# EasyEDA Pro project ProPrj_BrainStimulator-4Channels-Prototype_2025-12-16.epro, board PCB2
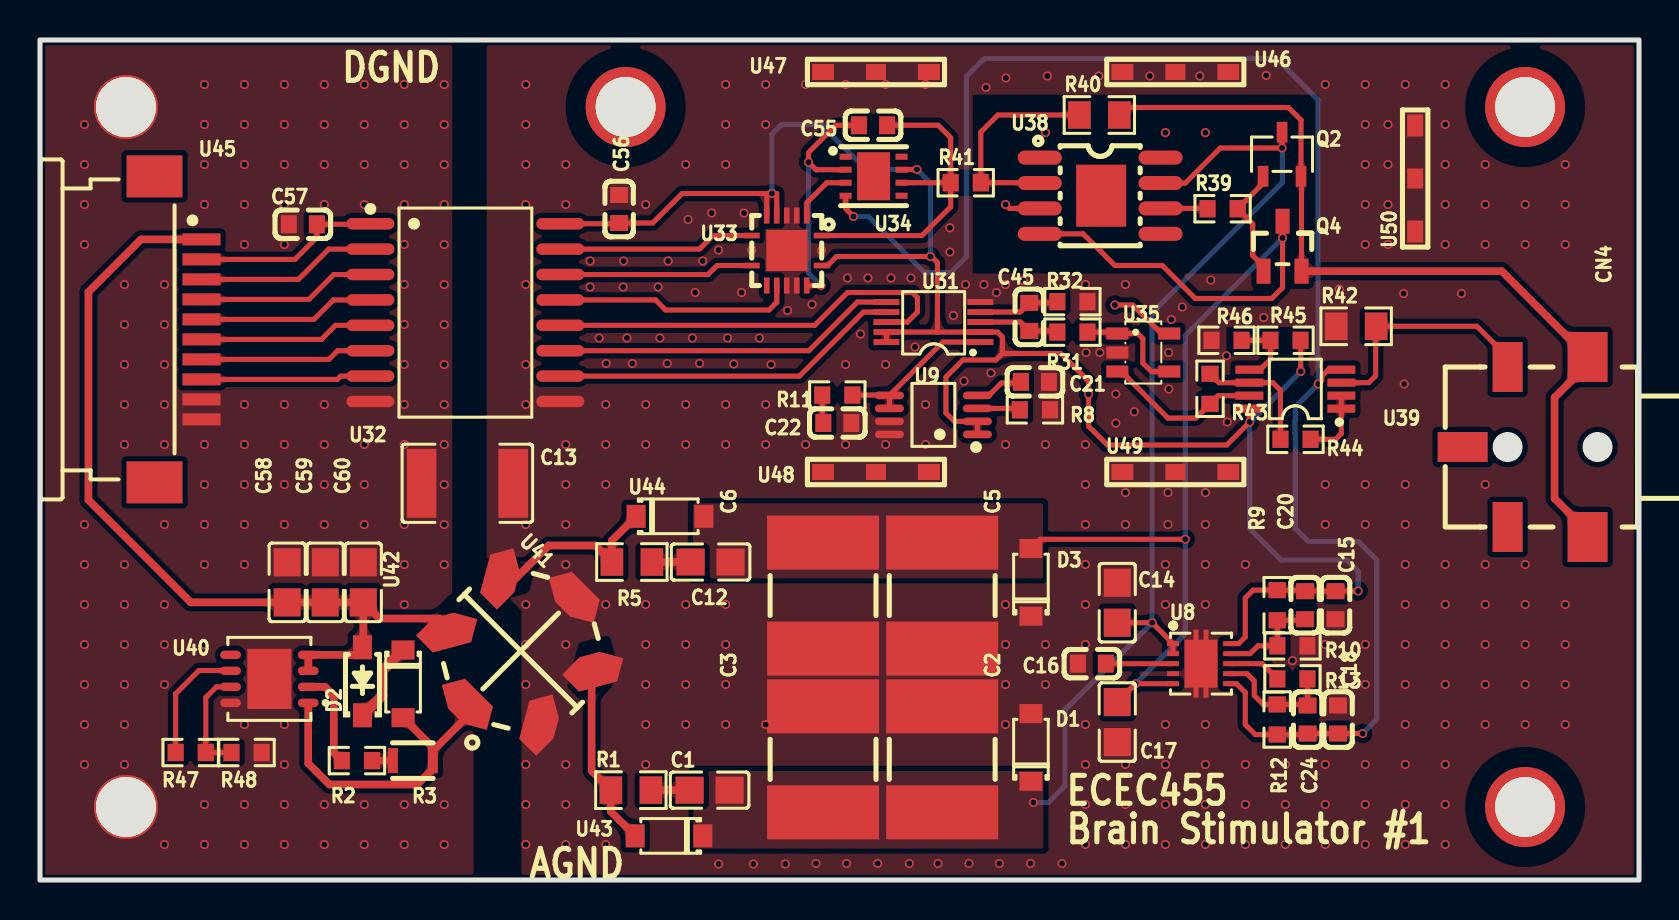
[diagram p9: board, top side]
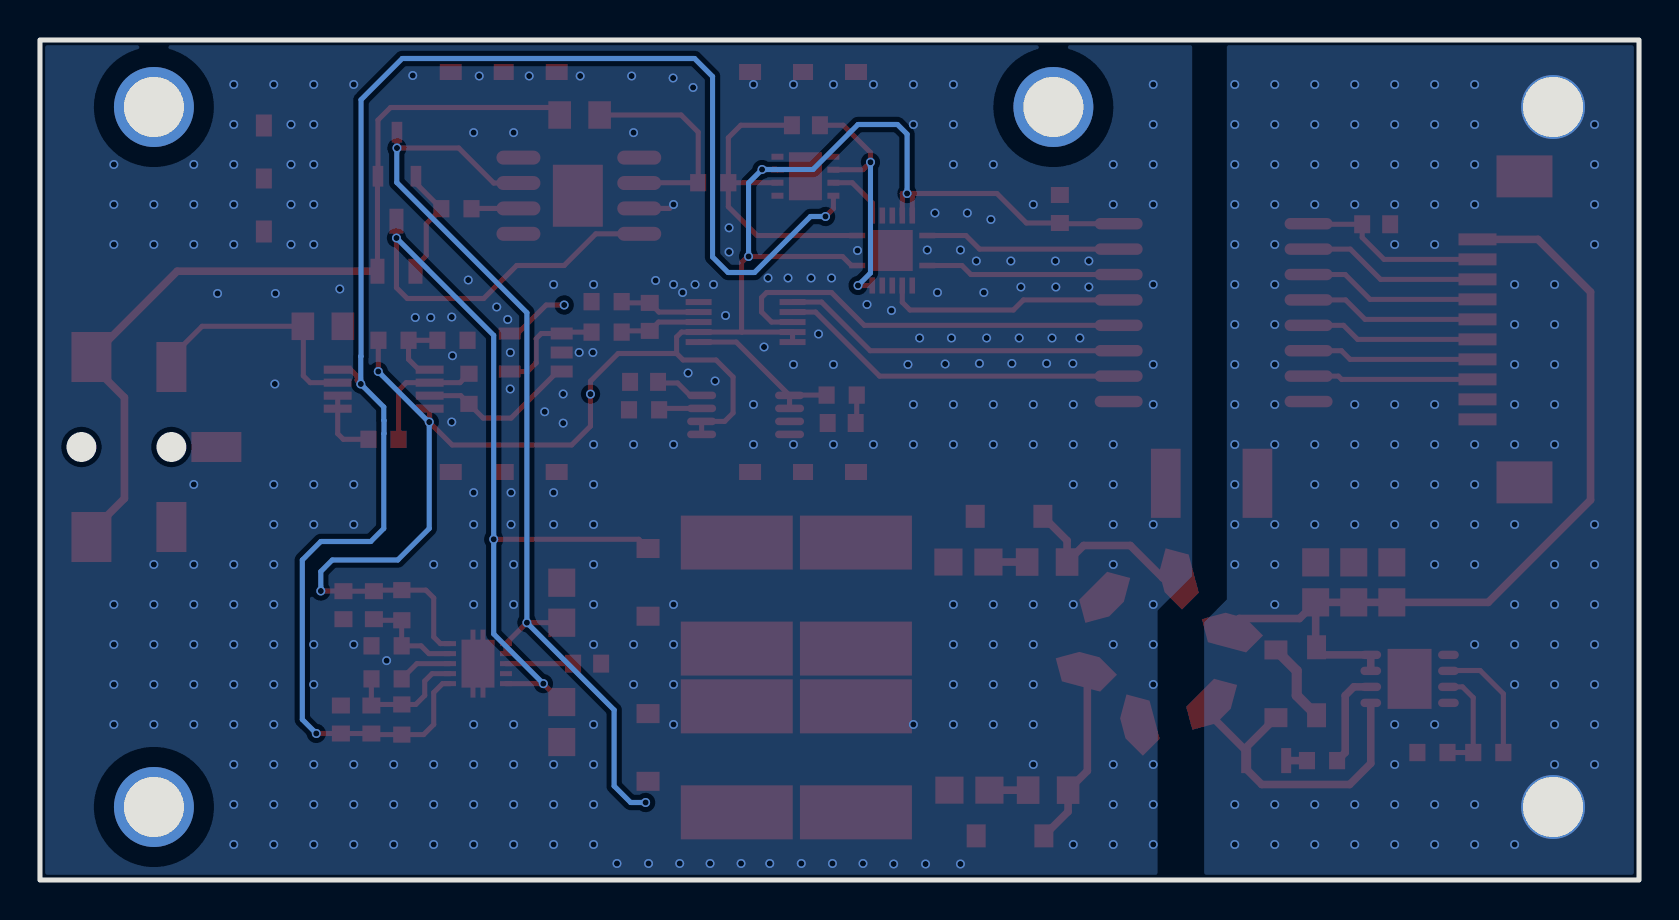
[diagram p10: board, bottom side, seen from below]

Outline 80 x 42 mm; copper layers: Top Layer, Inner1, Inner2, Bottom Layer. Coordinates in mm from the lower left corner of the outline.
Outline path: rectangle 0,42 80,0
Stack: Top Layer 0.035mm Outer layer thickness 1oz / Dielectric1 0.2104mm 7628 RC49% 8.6mil / Inner1 0.0152mm Inner layer thickness / Dielectric2 1.065mm 1.1mm H/HOZ Copper / Inner2 0.0152mm Inner layer thickness / Dielectric3 0.2104mm 7628 RC49% 8.6mil / Bottom Layer 0.035mm Outer layer thickness 1oz

## Design rules (mm)
spacing copperThickness1oz (default): track to track 0.102, other pairs 0.152 to 0.3
spacing copperThickness2oz: track to track 0.203, other pairs 0.152 to 0.3
spacing safeClearance_30V: track to track 0.254, other pairs 0.152 to 0.3
track width copperThickness1oz (default): min 0.127, default 0.254, max 2.54
track width copperThickness2oz: min 0.203, default 0.254, max 2.54
differential pair differentialPair (default): width min 0.127, default 0.254, max 2.54; gap min 0.152, default 0.152
pour e370 uses copperRegion_30V, safeClearance_30V
net AGND uses copperRegion_30V
net GND uses copperRegion_30V
net CH0_+5V uses copperRegion
pour e372 uses copperRegion_30V, safeClearance_30V
pour e548 uses copperRegion_30V, default
['net', 'agnd'] ['NET', '$1N3'] uses default

## Placement (name value [footprint] x y rotation side)
C1  22pF  [C0805]  33.5 4.49 0 top
C2  47uF  [CAP-SMD_L6.1-W5.3-L]  45.14 6.03 270 top
C3  47uF  [CAP-SMD_L6.1-W5.3-L]  39.18 6.03 270 top
C5  47uF  [CAP-SMD_L6.1-W5.3-L]  45.14 14.22 270 top
C6  47uF  [CAP-SMD_L6.1-W5.3-L]  39.18 14.22 270 top
C12  22pF  [C0805]  33.55 15.9 0 top
C13  1nF  [C1812]  21.38 19.84 0 top
C14  10uF  [C0805]  53.9 13.87 90 top
C15  10uF  [C0603]  64.82 13.74 270 top
C16  10nF  [C0603]  52.63 10.82 0 top
C17  10uF  [C0805]  53.9 7.9 90 top
C18  10uF  [C0603]  64.95 8.02 270 top
C20  10nF  [C0603]  63.29 13.74 270 top
C21  1uF  [C0603]  49.78 24.91 180 top
C22  22uF  [C0603]  39.89 22.85 0 top
C24  10nF  [C0603]  63.42 8.02 90 top
C45  1nF  [C0603]  49.49 28.16 270 top
C55  100nF  [C0603]  41.68 37.74 0 top
C56  100nF  [C0603]  28.98 33.55 90 top
C57  100nF  [C0603]  13.15 32.79 180 top
C58  10uF  [C0805]  12.37 14.88 270 top
C59  10uF  [C0805]  14.27 14.88 270 top
C60  100nF  [C0805]  16.18 14.88 270 top
CN4  SJ1-42534-SMT-TR  [AUDIO-SMD_SJ1-42534-SMT-TR]  74.3 21.65 270 top
D1  BZT52C30  [SOD-123_L2.8-W1.8-LS3.7-RD]  49.58 6.63 90 top
D2  BZT52C39  [SOD-123_L2.7-W1.6-LS3.7-RD-1]  16.13 9.94 90 top
D3  BZT52C30  [SOD-123_L2.8-W1.8-LS3.7-RD]  49.58 14.88 90 top
NOREF  -  [Pad_e987]  29.3 38.65 0 top
NOREF#2  -  [Pad_e985]  74.3 38.65 0 top
NOREF#3  -  [Pad_e983]  4.3 3.65 0 top
NOREF#4  -  [Pad_e986]  74.3 3.65 0 top
NOREF#5  -  [Pad_e984]  4.3 38.65 0 top
Q2  2N3904S-HXY  [SOT-23-3_L3.0-W1.7-P0.95-LS2.9-BR]  62.14 36.29 270 top
Q4  2N3906S-RTK/PS  [SOT-23-3_L2.9-W1.3-P1.90-LS2.4-TR]  62.17 31.69 270 top
R1  100Ω  [R0805]  29.56 4.49 0 top
R2  2.2kΩ  [R0603]  15.86 5.97 0 top
R3  301kΩ  [RES-SMD_L2.0-W1.3]  18.65 5.97 0 top
R5  100Ω  [R0805]  29.61 15.9 0 top
R8  120kΩ  [R0603]  49.78 23.51 180 top
R9  32.4kΩ  [R0603]  61.9 13.74 270 top
R10  10kΩ  [R0603]  62.66 11.71 0 top
R11  220mΩ  [R0603]  39.89 24.25 180 top
R12  42.2kΩ  [R0603]  61.9 8.02 90 top
R13  10kΩ  [R0603]  62.66 10.06 180 top
R31  15Ω  [R0603]  51.65 27.39 0 top
R32  15Ω  [R0603]  51.65 28.92 0 top
R39  20Ω  [R0603]  59.17 33.56 0 top
R40  5.1kΩ  [R0805]  53 38.25 0 top
R41  1kΩ  [R0603]  46.32 34.86 0 top
R42  30Ω  [R0805]  65.85 27.69 0 top
R43  50kΩ  [R0603]  58.54 24.56 270 top
R44  10kΩ  [R0603]  62.81 22.04 180 top
R45  15kΩ  [R0603]  62.31 26.98 180 top
R46  1kΩ  [R0603]  59.36 26.98 180 top
R47  604kΩ  [R0603]  7.54 6.37 0 top
R48  12.1kΩ  [R0603]  10.33 6.37 0 top
U8  TPS7A3901DSCR  [WSON-10_L3.0-W3.0-P0.50-BL-EP]  58.09 10.82 270 top
U9  REF6050IDGKR  [VSSOP-8_L3.0-W3.0-P0.65-LS4.9-BL]  44.7 23.26 90 top
U31  ADS8860IDGSR  [VSSOP-10_L3.0-W3.0-P0.50-LS4.9-BL]  44.7 27.9 90 top
U32  ISO7761DWR  [SOIC-16_L10.3-W7.5-P1.27-LS10.3-BL]  21.28 28.37 270 top
U33  DAC8831ICRGYT  [VQFN-14_L3.5-W3.5-P0.50-BL-EP]  37.36 31.47 180 top
U34  OPA727AIDRBT  [SON-8_L3.0-W3.0-P0.65-TL-EP]  41.7 35.19 0 top
U35  OPA320AIDBVR  [SOT-23-5_L3.0-W1.7-P0.95-LS2.8-BR]  55.2 26.37 180 top
U38  ADA4700-1ARDZ-R7  [SOIC-8_L4.9-W3.9-P1.27-LS6.0-BL-EP3.1]  53.04 34.21 270 top
U39  ADA4841-2YRMZ-R7  [MSOP-8_L3.0-W3.0-P0.65-LS4.9-BL]  62.81 24.54 90 top
U40  LM25184NGUR  [WSON-8_L4.0-W4.0-P0.80-BL-EP]  11.48 10.06 90 top
U41  -  [LPH8045]  24.05 11.45 135 top
U42  SS16FP  [SOD-123_L2.8-W1.8-LS3.7-RD]  18.17 9.81 270 top
U43  SS16FP  [SOD-123_L2.8-W1.8-LS3.7-RD]  31.47 2.21 180 top
U44  SS16FP  [SOD-123_L2.8-W1.8-LS3.7-RD]  31.52 18.18 0 top
U45  522711069  [FPC-SMD_10P-P1.00_522711069]  6.91 27.53 270 top
U46  ICSRC6508-025SFR  [SMD-3P_L6.5-W0.8_ICSRC6508-030SFR]  56.8 40.4 0 top
U47  ICSRC6508-025SFR  [SMD-3P_L6.5-W0.8_ICSRC6508-030SFR]  41.83 40.4 0 top
U48  ICSRC6508-025SFR  [SMD-3P_L6.5-W0.8_ICSRC6508-030SFR]  41.83 20.4 0 top
U49  ICSRC6508-025SFR  [SMD-3P_L6.5-W0.8_ICSRC6508-030SFR]  56.8 20.4 0 top
U50  ICSRC6508-025SFR  [SMD-3P_L6.5-W0.8_ICSRC6508-030SFR]  68.8 35.08 90 top

## Footprints (pads in the part's own frame, mm; a bottom-side part is the same pattern mirrored in y, then rotated)
AUDIO-SMD_SJ1-42534-SMT-TR
  rect 1.5x2.5 smd: 1(0,-3.125)
  rect 2.5x1.5 smd: 2(-4,-0.875) 3(4,-0.875)
  rect 2.5x2 smd: 4(-4.5,3.125) 4(4.5,3.125)
C0603
  rect 0.8x0.9 smd: 1(-0.7,0) 2(0.7,0)
C0805
  rect 1.41x1.35 smd: 1(-1,0) 2(1,0)
C1812
  rect 1.485x3.456 smd: 1(-2.292,0) 2(2.292,0)
CAP-SMD_L6.1-W5.3-L
  rect 2.7x5.6 smd: 1(-2.65,0) 2(2.65,0)
FPC-SMD_10P-P1.00_522711069
  rect 0.6x1.9 smd: 1(-4.5,1.175) 2(-3.5,1.175) 3(-2.5,1.175) 4(-1.5,1.175) 5(-0.5,1.175) 6(0.5,1.175) 7(1.5,1.175) 8(2.5,1.175) 9(3.5,1.175) 10(4.5,1.175)
  rect 2.1x2.8 smd: MP1(-7.65,-1.175) MP2(7.65,-1.175)
LPH8045
  custom 3.174x1.651 smd: 1(0,3.782) 4(0,-3.782)
  custom 2.184x2.748 smd rot 60: 2(-3.276,1.891) 5(3.276,-1.891)
  custom 2.184x2.748 smd rot 120: 3(-3.276,-1.891) 6(3.276,1.891)
MSOP-8_L3.0-W3.0-P0.65-LS4.9-BL
  rect 0.406x1.397 smd: 1(-0.975,-2.3) 2(-0.325,-2.3) 3(0.325,-2.3) 4(0.975,-2.3) 5(0.975,2.3) 6(0.325,2.3) 7(-0.325,2.3) 8(-0.975,2.3)
Pad_e983
  round 3.2 hole 3: 1(0,0)
Pad_e984
  round 3.2 hole 3: 1(0,0)
Pad_e985
  round 4 hole 3: 1(0,0)
Pad_e986
  round 4 hole 3: 1(0,0)
Pad_e987
  round 4 hole 3: 1(0,0)
R0603
  rect 0.806x0.864 smd: 1(-0.753,0) 2(0.753,0)
R0805
  rect 1.133x1.377 smd: 1(-1,0) 2(1,0)
RES-SMD_L2.0-W1.3
  rect 0.5x1.25 smd: 1(-1,0) 2(1,0)
SMD-3P_L6.5-W0.8_ICSRC6508-030SFR
  rect 1.1x0.8 smd: 1(-2.65,0) 3(2.65,0)
  rect 1x0.8 smd: 2(0,0)
SOD-123_L2.7-W1.6-LS3.7-RD-1
  rect 1.2x0.95 smd: 1(-1.7,0) 2(1.7,0)
SOD-123_L2.8-W1.8-LS3.7-RD
  rect 0.95x1.15 smd: 1(-1.692,0) 2(1.692,0)
SOIC-8_L4.9-W3.9-P1.27-LS6.0-BL-EP3.1
  oval 0.7x2.2 smd: 1(-1.905,-3.022) 2(-0.635,-3.022) 3(0.635,-3.022) 4(1.905,-3.022) 5(1.905,3.022) 6(0.635,3.022) 7(-0.635,3.022) 8(-1.905,3.022)
  rect 3.1x2.5 smd: 9(0,0.051)
SOIC-16_L10.3-W7.5-P1.27-LS10.3-BL
  oval 0.574x2.401 smd: 1(-4.445,-4.75) 2(-3.175,-4.75) 3(-1.905,-4.75) 4(-0.635,-4.75) 5(0.635,-4.75) 6(1.905,-4.75) 7(3.175,-4.75) 8(4.445,-4.75) 9(4.445,4.75) 10(3.175,4.75) 11(1.905,4.75) 12(0.635,4.75) 13(-0.635,4.75) 14(-1.905,4.75) 15(-3.175,4.75) 16(-4.445,4.75)
SON-8_L3.0-W3.0-P0.65-TL-EP
  rect 0.6x0.3 smd: 1(-1.4,0.976) 2(-1.4,0.325) 3(-1.4,-0.325) 4(-1.4,-0.976) 5(1.4,-0.976) 6(1.4,-0.325) 7(1.4,0.325) 8(1.4,0.976)
  rect 1.65x2.4 smd: 9(0,0)
SOT-23-3_L2.9-W1.3-P1.90-LS2.4-TR
  rect 1.25x0.7 smd: 1(1.25,0.95) 2(1.25,-0.95) 3(-1.25,0)
SOT-23-3_L3.0-W1.7-P0.95-LS2.9-BR
  rect 1.038x0.532 smd: 1(1.101,-0.95) 2(1.101,0.95) 3(-1.101,0)
SOT-23-5_L3.0-W1.7-P0.95-LS2.8-BR
  rect 1.1x0.6 smd: 1(1.3,-0.95) 2(1.3,0) 3(1.3,0.95) 4(-1.3,0.95) 5(-1.3,-0.95)
VQFN-14_L3.5-W3.5-P0.50-BL-EP
  rect 0.8x0.28 smd: 1(-1.75,-0.75) 7(1.75,-0.75) 8(1.75,0.75) 14(-1.75,0.75)
  rect 0.28x0.8 smd: 2(-0.999,-1.75) 3(-0.498,-1.75) 4(0.002,-1.75) 5(0.501,-1.75) 6(1.002,-1.75) 9(1,1.75) 10(0.5,1.75) 11(0,1.75) 12(-0.5,1.75) 13(-1,1.75)
  rect 2.05x2.05 smd: 15(0,0)
VSSOP-8_L3.0-W3.0-P0.65-LS4.9-BL
  oval 0.38x1.45 smd: 1(-0.975,-2.2) 2(-0.325,-2.2) 3(0.325,-2.2) 4(0.975,-2.2) 5(0.975,2.2) 6(0.325,2.2) 7(-0.325,2.2) 8(-0.975,2.2)
VSSOP-10_L3.0-W3.0-P0.50-LS4.9-BL
  rect 0.3x1.3 smd: 1(-1,-2.35) 2(-0.5,-2.35) 3(0,-2.35) 4(0.5,-2.35) 5(1,-2.35) 6(1,2.35) 7(0.5,2.35) 8(0,2.35) 9(-0.5,2.35) 10(-1,2.35)
WSON-8_L4.0-W4.0-P0.80-BL-EP
  oval 0.42x1.035 smd: 1(-1.2,-1.942) 2(-0.4,-1.942) 3(0.4,-1.942) 4(1.2,-1.942) 5(1.2,1.942) 6(0.4,1.942) 7(-0.4,1.942) 8(-1.2,1.942)
  rect 3x2.2 smd: 9(0,0)
WSON-10_L3.0-W3.0-P0.50-BL-EP
  rect 0.25x0.6 smd: 1(-1.001,-1.4) 2(-0.5,-1.4) 3(0,-1.4) 4(0.5,-1.4) 5(1.001,-1.4) 6(1.001,1.4) 7(0.5,1.4) 8(0,1.4) 9(-0.5,1.4) 10(-1.001,1.4)
  custom 3.4x1.65 smd: 11(0,0)

## Nets
As in the schematic, except:
GND: C13.1 C57.2 C58.1 C59.1 C60.1 NOREF#3.1 NOREF#5.1 R48.2 U32.8 U40.8 U40.9 U45.9 U45.10

Pads without a net: CN4 1 3; NOREF 1; NOREF#2 1; NOREF#4 1; U33 9; U34 1 5 8 9; U38 1 5 8 9; U40 5; U45 MP1 MP2

## Via types
v1: diameter 0.45, hole 0.305, Top Layer to Bottom Layer, 412 vias

## Routing (per net, layer and track width the routed paths; a pad name or vN(x,y) marks a point on that pad's centre or on a via; arc(x,y) is an arc through that point)
3V3: length 9.6
  Top Layer w0.254: U32.1 16.5,32.79 C57.1 13.85,32.13 12.76,31.03 U45.2
AGND: length 1.8
  Top Layer w0.254: v1(48.3,33.78) 48.5,33.58 U38.3
  vias: v1(24.3,39.78) v1(24.3,37.78) v1(24.3,35.78) v1(24.3,33.78) v1(24.3,29.78) v1(24.3,25.78) v1(24.3,23.78) v1(24.3,17.78) v1(24.3,13.78) v1(24.3,11.78) v1(24.3,9.78) v1(24.3,5.78) v1(24.3,3.78) v1(24.3,1.78) v1(26.3,35.78) v1(26.3,33.78) v1(26.3,21.78) v1(26.3,19.78) v1(26.3,17.78) v1(26.3,15.78) v1(26.3,11.78) v1(26.3,5.78) v1(26.3,3.78) v1(26.3,1.78) v1(27.52,30.95) v1(27.52,29.65) v1(27.98,27.1) v1(28.33,25.83) v1(28.3,23.78) v1(28.3,21.78) v1(28.3,19.78) v1(28.3,13.78) v1(28.3,1.78) v1(29.2,30.95) v1(29.18,29.65) v1(29.37,27.1) v1(29.64,25.83) v1(30.3,33.78) v1(30.3,23.78) v1(30.3,21.78) v1(30.3,13.78) v1(30.3,11.78) v1(30.3,9.78) v1(30.3,7.78) v1(30.3,5.78) v1(30.92,29.65) v1(31.01,27.1) v1(31.43,30.95) v1(31.38,25.83) v1(32.3,35.78) v1(32.3,23.78) v1(32.3,21.78) v1(32.3,13.78) v1(32.3,11.78) v1(32.3,9.78) v1(32.3,7.78) v1(32.42,33.03) v1(32.64,27.1) v1(32.78,29.38) v1(33,25.83) v1(33.16,30.95) v1(33.61,33.35) v1(33.95,31.5) v1(33.95,0.8) v1(34.3,39.78) v1(34.3,37.78) v1(34.3,35.78) v1(34.3,23.78) v1(34.3,21.78) v1(34.3,13.78) v1(34.3,11.78) v1(34.3,9.78) v1(34.3,7.78) v1(34.4,27.1) v1(34.71,25.8) v1(35.1,29.38) v1(35.23,33.35) v1(35.61,31.5) v1(35.69,0.8) v1(35.99,27.1) v1(36.3,39.78) v1(36.3,37.78) v1(36.3,23.78) v1(36.3,21.78) v1(36.3,7.78) v1(36.58,25.78) v1(37.29,0.8) v1(37.4,28.48) v1(38.3,39.78) v1(38.3,21.78) v1(38.62,28.78) v1(38.83,0.83) v1(39.1,31.48) v1(40.3,39.78) v1(40.3,25.78) v1(40.3,21.78) v1(40.4,30.1) v1(40.35,0.83) v1(41.05,27.3) v1(41.42,30.1) v1(41.91,0.83) v1(42.3,39.78) v1(42.3,25.78) v1(42.3,21.78) v1(42.58,30.1) v1(43.49,0.83) v1(43.58,30.1) v1(43.77,26.65) v1(44.3,39.78) v1(44.3,23.78) v1(44.3,21.78) v1(44.92,0.83) v1(45.52,32.61) v1(45.52,31.4) v1(45.7,28.23) v1(46.23,24.95) v1(46.3,29.78) v1(46.48,0.83) v1(47.23,29.78) v1(47.33,39.62) v1(47.58,25.35) v1(47.85,29.38) v1(48,0.83) v1(48.33,40.1) v1(48.3,29.78) v1(48.3,21.78) v1(48.3,13.78) v1(48.3,11.78) v1(48.3,9.78) v1(48.3,7.78) v1(49.2,29.98) v1(49.55,0.83) v1(50.3,37.37) v1(50.3,21.78) v1(50.3,11.78) v1(50.3,9.78) v1(50.4,40.2) v1(51.13,0.83) v1(52.3,29.78) v1(52.34,26.37) v1(52.3,21.78) v1(52.3,19.78) v1(52.3,17.78) v1(52.3,15.78) v1(52.3,13.78) v1(52.3,11.78) v1(52.3,7.78) v1(52.3,5.78) v1(52.3,3.78) v1(52.3,1.78) v1(52.98,40.2) v1(53.02,26.38) v1(53.83,24.3) v1(53.83,22.84) v1(54.3,29.78) v1(54.3,19.37) v1(54.3,17.78) v1(54.3,5.78) v1(54.3,3.78) v1(54.3,1.78) v1(54.75,23.41) v1(55.52,40.2) v1(56.3,37.37) v1(56.3,15.78) v1(56.3,13.78) v1(56.3,7.78) v1(56.3,5.78) v1(56.3,3.78) v1(56.3,1.78) v1(56.43,19.37) v1(56.43,17.78) v1(56.47,26.37) v1(56.48,24.55) v1(56.6,28.03) v1(57.15,28.65) v1(58.02,40.2) v1(58.3,37.37) v1(58.3,19.37) v1(58.3,17.78) v1(58.3,15.78) v1(58.3,13.78) v1(58.3,7.78) v1(58.3,5.78) v1(58.3,3.78) v1(58.3,1.78) v1(58.58,30) v1(59.4,28.15) v1(59.36,26.21) v1(59.4,22.9) v1(60.3,15.78) v1(60.3,5.78) v1(60.3,3.78) v1(60.3,1.78) v1(60.45,28.12) v1(61.23,28.12) v1(61.35,40.23) v1(62.3,5.78) v1(62.3,3.78) v1(62.3,1.78) v1(62.66,10.97) v1(64.3,39.78) v1(64.3,19.78) v1(64.3,17.78) v1(64.3,11.78) v1(64.3,5.78) v1(64.3,3.78) v1(64.3,1.78) v1(65,29.55) v1(66.3,39.78) v1(66.3,37.78) v1(66.3,35.78) v1(66.3,33.78) v1(66.3,31.78) v1(66.3,19.78) v1(66.3,17.78) v1(66.3,11.78) v1(66.3,9.78) v1(66.3,5.78) v1(66.3,3.78) v1(66.3,1.78) v1(67.44,37.78) v1(67.44,35.78) v1(67.44,33.78) v1(67.44,31.78) v1(68.23,29.33) v1(68.25,24.8) v1(68.3,39.78) v1(68.3,19.78) v1(68.3,17.78) v1(68.3,15.78) v1(68.3,13.78) v1(68.3,11.78) v1(68.3,9.78) v1(68.3,7.78) v1(68.3,5.78) v1(68.3,3.78) v1(68.3,1.78) v1(70.3,39.78) v1(70.3,37.78) v1(70.3,35.78) v1(70.3,33.78) v1(70.3,31.78) v1(70.3,15.78) v1(70.3,13.78) v1(70.3,11.78) v1(70.3,9.78) v1(70.3,7.78) v1(70.3,5.78) v1(70.3,3.78) v1(70.3,1.78) v1(71.12,29.33) v1(72.3,35.78) v1(72.3,33.78) v1(72.3,31.78) v1(72.3,19.78) v1(72.3,15.78) v1(72.3,13.78) v1(72.3,11.78) v1(72.3,9.78) v1(72.3,7.78) v1(74.3,33.78) v1(74.3,31.78) v1(74.3,15.78) v1(74.3,13.78) v1(74.3,11.78) v1(74.3,9.78) v1(74.3,7.78) v1(76.3,35.78) v1(76.3,33.78) v1(76.3,31.78) v1(76.3,13.78) v1(76.3,11.78) v1(76.3,9.78) v1(76.3,7.78)
GND:
  vias: v1(2.22,37.78) v1(2.22,35.78) v1(2.22,33.78) v1(2.22,31.78) v1(2.22,17.78) v1(2.22,15.78) v1(2.22,13.78) v1(2.22,11.78) v1(2.22,9.78) v1(2.22,7.78) v1(2.22,5.78) v1(4.22,29.78) v1(4.22,27.78) v1(4.22,25.78) v1(4.22,23.78) v1(4.22,21.78) v1(4.22,15.78) v1(4.22,13.78) v1(4.22,11.78) v1(4.22,9.78) v1(4.22,7.78) v1(4.22,5.78) v1(6.22,29.78) v1(6.22,27.78) v1(6.22,25.78) v1(6.22,23.78) v1(6.22,21.78) v1(6.22,17.78) v1(6.22,13.78) v1(6.22,11.78) v1(6.22,9.78) v1(6.22,1.78) v1(8.22,39.78) v1(8.22,37.78) v1(8.22,35.78) v1(8.22,33.78) v1(8.22,21.78) v1(8.22,19.78) v1(8.22,17.78) v1(8.22,15.78) v1(8.22,11.78) v1(8.22,3.78) v1(8.22,1.78) v1(10.22,39.78) v1(10.22,37.78) v1(10.22,35.78) v1(10.22,33.78) v1(10.22,31.78) v1(10.22,23.78) v1(10.22,21.78) v1(10.22,19.78) v1(10.22,17.78) v1(10.22,15.78) v1(10.22,7.78) v1(10.22,3.78) v1(10.22,1.78) v1(12.22,39.78) v1(12.22,37.78) v1(12.22,35.78) v1(12.22,33.78) v1(12.22,31.78) v1(12.22,23.78) v1(12.22,21.78) v1(12.22,19.78) v1(12.22,17.78) v1(12.22,7.78) v1(12.22,5.78) v1(12.22,3.78) v1(12.22,1.78) v1(14.22,39.78) v1(14.22,37.78) v1(14.22,35.78) v1(14.22,33.78) v1(14.22,23.78) v1(14.22,21.78) v1(14.22,19.78) v1(14.22,17.78) v1(14.22,3.78) v1(14.22,1.78) v1(16.22,39.78) v1(16.22,37.78) v1(16.22,35.78) v1(16.22,33.78) v1(16.22,21.78) v1(16.22,19.78) v1(16.22,17.78) v1(16.22,3.78) v1(16.22,1.78) v1(18.22,39.78) v1(18.22,37.78) v1(18.22,35.78) v1(18.22,33.78) v1(18.22,31.78) v1(18.22,29.78) v1(18.22,27.78) v1(18.22,25.78) v1(18.22,23.78) v1(18.22,21.78) v1(18.22,17.78) v1(18.22,15.78) v1(18.22,13.78) v1(18.22,3.78) v1(18.22,1.78) v1(20.22,39.78) v1(20.22,37.78) v1(20.22,35.78) v1(20.22,33.78) v1(20.22,31.78) v1(20.22,29.78) v1(20.22,27.78) v1(20.22,25.78) v1(20.22,23.78) v1(20.22,21.78) v1(20.22,19.78) v1(20.22,17.78) v1(20.22,15.78) v1(20.22,3.78) v1(20.22,1.78)
ADC_CS: length 8.6
  Top Layer w0.254: U45.7 14.46,26.03 14.89,26.46 U32.6
ADC_MISO: length 8.5
  Top Layer w0.254: U32.7 15.04,25.19 14.88,25.03 U45.8
ADC_SCLK: length 8.7
  Top Layer w0.254: U45.6 14.08,27.03 14.78,27.73 U32.5
CH0_5VN_BUF: length 2.7
  Top Layer w0.254: R13.2 61.14,10.82 U8.8
CH0_5VN_FB: length 6.4
  Top Layer w0.254: U8.7 60.38,10.32 60.75,9.95 60.75,9.23 61.2,8.78 R12.2 63.37,8.78 C24.2 63.42,10.05 R13.1
CH0_5VP_FB: length 5.3
  Top Layer w0.254: C20.2 63.24,12.99 R9.2 61.91,12.98 R10.1 60.93,11.71 60.54,11.32 U8.9
CH0_+5V: length 107.6
  Top Layer w0.254: R45.1 63.08,26.98 v1(63.08,25.43) ; 48.15,26.33 48.15,27.15 47.9,27.4 U31.2 44.88,27.4 ; 48.15,26.33 51.08,26.33 52.46,24.94 v1(52.46,24.29) 52.46,22.69 53.4,21.75 59.37,21.75 v1(60.52,22.9) 60.51,22.92 U39.8 ; 48.15,26.33 47.83,26 46.17,26 45.33,25.15 45.33,23.35 45.74,22.93 U9.2 U9.1 ; v1(53.77,28.75) 54.67,28.75 56.1,27.32 U35.5 ; U33.6 36.36,34.32 36.36,34.33 ; 36.36,34.33 32.12,34.33 30.65,32.85 C56.1 28.94,32.81 U32.16 ; 36.36,34.33 v1(36.62,34.33) 36.86,34.33 U33.5 ; v1(65.95,14.45) 64.83,14.45 C15.1 C20.1 63.24,14.49 R9.1 60.69,14.49 60.3,14.1 60.3,12.15 59.97,11.82 59.49,11.82 ; 44.88,27.4 U31.9 U31.10 ; 44.88,27.4 44.9,27.41 44.9,30.88 44.6,31.18 39.85,31.18 39.4,30.72 U33.14 ; U34.7 43.12,35.53 v1(43.87,35.53)
  Inner2 w0.254: v1(52.46,24.29) 51.65,25.1 51.65,27.62 52.77,28.75 v1(53.77,28.75)
  Bottom Layer w0.254: v1(44.55,31.18) 44.55,34.85 v1(43.87,35.53) 41.33,35.53 39.08,37.78 37.1,37.78 36.62,37.29 v1(36.62,34.33) ; v1(65.95,14.45) 65.95,15.43 65.37,16 62.1,16 60.52,17.58 v1(60.52,22.9) 60.55,22.9 v1(63.08,25.43)
CH0_+30V: length 49.6
  Top Layer w0.254: Q2.3 v1(62.14,36.6) 59.05,36.6 57.3,34.85 U38.7 ; C14.1 v1(55.64,12.87) 56.69,11.82 U8.2
  Bottom Layer w0.254: v1(62.14,36.6) 62.15,36.59 62.15,34.88 55.64,28.37 v1(55.64,12.87) 51.27,8.5 51.27,4.7 50.45,3.88 v1(49.7,3.88)
CH0_-5V: length 82.1
  Top Layer w0.254: U34.4 40.3,33.57 v1(40.7,33.18) ; v1(66.17,7.33) 64.95,7.33 ; 65.11,25.52 64.46,25.52 64.13,25.19 64.13,24.98 v1(63.95,24.8) ; U8.6 59.86,9.82 60.3,9.38 60.3,7.78 60.8,7.27 R12.1 63.37,7.27 C24.1 C18.2
  Bottom Layer w0.254: v1(40.7,33.18) 41.45,33.18 44.25,30.38 45.58,30.38 46.35,31.15 46.35,40.18 47.25,41.08 61.87,41.08 63.94,39.01 63.94,26.19 63.95,26.18 v1(63.95,24.8) 62.8,23.65 62.8,22.99 62.79,22.98 62.79,22.32 62.8,22.31 62.8,17.58 63.45,16.93 65.95,16.93 66.87,16 66.87,8.03 v1(66.17,7.33)
CH0_-30V: length 53.4
  Top Layer w0.254: C17.2 v1(54.82,9.82) U8.5 ; Q4.3 v1(62.17,32.1) 62.17,29.62 61.62,29.08 57.8,29.08 56.15,30.73 53.77,30.73 52.19,32.31 U38.4 ; v1(57.3,17.04) 50.04,17.04 D3.2
  Bottom Layer w0.254: v1(62.17,32.1) 57.3,27.23 v1(57.3,17.04) 57.3,12.3 v1(54.82,9.82)
CH0_ADC_IN_N: length 4.1
  Top Layer w0.254: U31.4 49.04,28.4 C45.1 50.84,28.86 R32.1
CH0_ADC_IN_P: length 4.1
  Top Layer w0.254: R31.1 50.84,27.46 C45.2 49.05,27.9 U31.3
CH0_ADC_VREF: length 8.2
  Top Layer w0.254: U31.1 45.17,26.9 U9.5 ; R11.1 42.48,24.25 U9.5 ; U9.5 U9.6
CH0_BRAIN_FB: length 12.1
  Top Layer w0.254: CN4.2 73.42,26.15 71.89,27.69 66.83,27.69 66.83,25.21 66.48,24.87 65.11,24.87
CH0_FLYBACK_FB: length 4.9
  Top Layer w0.381: R2.1 14.7,6.37 14.7,9.23 14.27,9.66 U40.2
CH0_FLYBACK_SW: length 15.8
  Top Layer w0.381: U41.1 21.38,8.18 19.65,6.45 19.65,6.63 U42.2 ; R3.2 19.65,5.55 18.88,4.78 14.47,4.78 13.42,5.83 U40.1
CH0_OPAMP_DAC: length 16.4
  Top Layer w0.254: U34.6 R41.1 ; R41.1 45.56,33.66 44.12,32.22 U33.1 ; R41.1 45.56,37.11 44.94,37.74 C55.2
CH0_OUT_BRAIN: length 43.5
  Top Layer w0.254: R40.2 54.37,38.62 62.46,38.62 63.09,38 63.09,35.19 63.12,35.16 Q4.1
  Top Layer w0.381: CN4.4 77.43,17.42 75.77,19.08 75.77,24.12 77.43,25.78 CN4.4 73.14,30.44 Q4.1
CH0_VSENSE_ADC: length 8
  Top Layer w0.254: U39.7 58.95,24.22 R43.2 57.83,23.09 56.43,23.09 54.1,25.42 U35.3
CS: length 9.1
  Top Layer w0.254: U32.2 14.44,31.54 12.93,30.03 U45.3
DAC_INV: length 12.7
  Top Layer w0.254: C55.1 39.81,37.74 38.45,36.38 v1(38.45,35.89) 38.83,35.51 U34.2 ; 39.07,29.72 U33.13
  Bottom Layer w0.254: v1(39.08,29.73) 38.45,30.35 v1(38.45,35.89)
DAC_OUT: length 3
  Top Layer w0.254: U33.2 38.36,33.86 39.36,34.86 U34.3
ISO_ADC_CS: length 17.3
  Top Layer w0.254: U32.11 38.46,26.46 40.9,28.9 U31.6
ISO_ADC_MISO: length 17.6
  Top Layer w0.254: U31.7 41.2,28.4 37.99,25.19 U32.10
ISO_ADC_SCLK: length 21.1
  Top Layer w0.254: U31.8 43.4,27.9 43.9,28.4 43.9,29.12 43.65,29.38 40.4,29.38 38.76,27.73 U32.12
ISO_CS: length 9.9
  Top Layer w0.254: 35.61,32.22 33.67,32.22 32.99,31.54 U32.15
ISO_MOSI: length 12
  Top Layer w0.254: U32.13 30.8,29 31.3,28.5 36.48,28.5 36.86,28.89 U33.10
ISO_SCLK: length 9.8
  Top Layer w0.254: U32.14 33.42,30.27 33.87,30.72 35.61,30.72
MOSI: length 8.9
  Top Layer w0.254: U45.5 13.71,28.03 14.68,29 U32.4
SCLK: length 9
  Top Layer w0.254: U32.3 14.7,30.27 13.46,29.03 U45.4
VSYS: length 43.9
  Top Layer w0.381: U45.1 5.06,32.03 2.42,29.4 2.42,19 7.54,13.88 C58.2 C59.2 C60.2 ; C60.2 16.18,11.68 D2.2 15.75,11.26 U40.4 U40.3 ; C60.2 16.98,13.08 20,13.08 20.4,12.68 U41.6
$1N3: length 3.7
  Top Layer w0.254: R46.1 R45.2 61.56,26.03 61.05,25.52 60.51,25.52
$1N11: length 10.8
  Top Layer w0.254: U38.2 50,34.86 R41.2 47.07,37.39 47.92,38.25 R40.1
$1N15: length 5.8
  Top Layer w0.254: 61.19,35.19 61.19,34.84 R39.2 60.67,32.81 60.67,31.23 61.22,30.68 Q4.2
$1N16: length 2.4
  Top Layer w0.254: U38.6 58.4,33.58 R39.1
$1N24: length 1.4
  Top Layer w0.254: C22.1 39.14,22.9 R11.2
$1N33: length 2.5
  Top Layer w0.254: C21.2 49.02,24.85 48.1,24.85 47.48,24.23 U9.4
$1N34: length 2.2
  Top Layer w0.254: R8.2 48.95,23.58 U9.3
$1N35: length 5.6
  Top Layer w0.254: U35.4 55.6,25.42 55.17,25.85 55.17,27.07 54.92,27.32 U35.1 53.83,27.39 R31.2
$1N47: length 3.4
  Top Layer w0.254: C16.2 U8.3
$1N76: length 1
  Top Layer w0.381: R3.1 R2.2
$1N77: length 6.3
  Top Layer w0.254: R43.1 58.98,24.87 61.68,24.87 62.06,24.49 R44.2
$1N80: length 5.5
  Top Layer w0.254: R48.1 R47.2 8.29,9.12 8.83,9.66 U40.7
$1N81: length 6.2
  Top Layer w0.254: U40.6 9.52,10.48 7.95,10.48 6.79,9.31 R47.1
$1N89: length 3.6
  Top Layer w0.254: U39.2 U39.1 65.11,22.32 64.82,22.04 R44.1
$1N92: length 4.1
  Top Layer w0.508: D2.1 17.12,9.23 17.12,10.46 U42.1
$1N95: length 1.9
  Top Layer w0.381: R5.2 C12.1
$1N96: length 1.9
  Top Layer w0.381: R1.2 C1.1
$1N98: length 9.3
  Top Layer w0.381: U41.5 23.83,15.11 25.45,16.73 27.79,16.73 R5.1 28.61,16.97 U44.1
$1N99: length 9.2
  Top Layer w0.381: U43.2 28.56,3.42 R1.1 27.6,5.46 27.6,10.37 U41.3

## Copper pours and planes (outline as drawn; the poured copper is in the pictures)
AGND on Top Layer: 21.95,42 81.72,42 81.72,0 21.95,0
AGND on Bottom Layer: 22.01,42 81.81,42 81.81,0 22.01,0
AGND on Inner1: 22.14,42 80.83,42 80.83,0 22.14,0
AGND on Inner2: 22.09,42 81.25,42 81.25,0.03 22.09,0.03
GND on Top Layer: 0,42 22.33,42 22.33,-0.02 0,-0.02
GND on Bottom Layer: 0,42 22.33,42 22.33,-0.02 0,-0.02
GND on Inner1: 0,42 22.33,42 22.33,-0.02 0,-0.02
GND on Inner2: 0,42 22.33,42 22.33,-0.02 0,-0.02
CH0_+30V on Top Layer: 32.7,5.45 50.2,5.45 50.2,1.58 32.7,1.58
CH0_-30V on Top Layer: 32.67,18.84 50.17,18.84 50.17,15.09 32.67,15.09

Small or netless copper shapes (teardrops, artwork), in the pictures only: 227 on Top Layer, 22 on Bottom Layer, 2 on Inner2

## Text on the board
Top Silkscreen Layer: DGND | AGND | ECEC455 | Brain Stimulator #1
